# Altium project Analog Project.PrjPcb
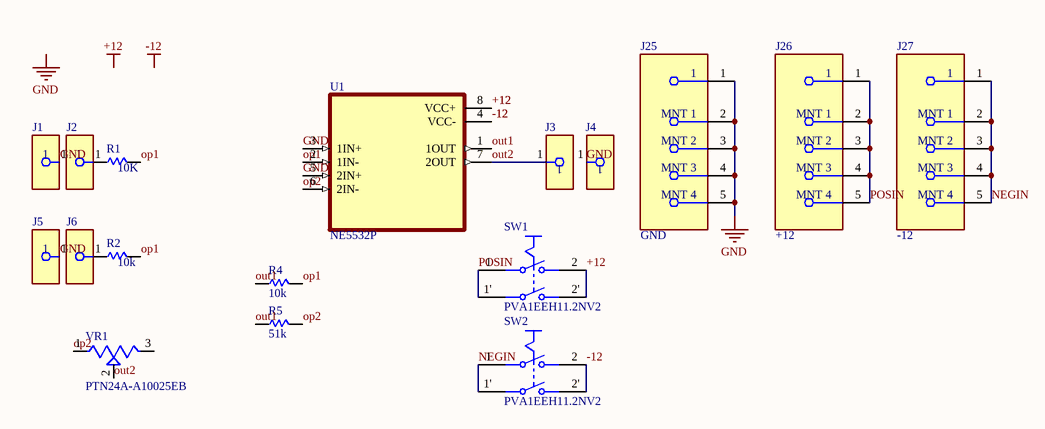
[diagram p0: Adder.SchDoc]
6 sheets, 157 parts. Net scope: global (net labels, ports and power ports of the same name join across sheets).
Board file: PCB1.PcbDoc
Sheets:
  Adder.SchDoc
  Subtractor.SchDoc
  Multiplier.SchDoc
  logMultiplier.SchDoc
  Intdiff.SchDoc
  gain.SchDoc

## Sheet Adder.SchDoc
size A; SheetNumber: 1; SheetTotal: 6

### Parts
J1  (no value)  [FP-1581-5-MFG]
J2  1581-5  [FP-1581-5-MFG]  (value not drawn)
J3  1581-5  [FP-1581-5-MFG]  (value not drawn)
J4  1581-5  [FP-1581-5-MFG]  (value not drawn)
J5  1581-5  [FP-1581-5-MFG]  (value not drawn)
J6  1581-5  [FP-1581-5-MFG]  (value not drawn)
J25  GND  [FP-FCR7350B-MFG]
J26  +12  [FP-FCR7350B-MFG]
J27  -12  [FP-FCR7350B-MFG]
R1  value 10K  [RESAD1100W55L680D260]  (hidden comment: MFR-25FBF52-1K)
R2  value 10k  [RESAD1100W55L680D260]  (hidden comment: MFR-25FBF52-1K)
R4  value 10k  [RESAD1100W55L680D260]  (hidden comment: MFR-25FBF52-1K)
R5  value 51k  [RESAD1100W55L680D260]  (hidden comment: MFR-25FBF52-1K)
SW1  PVA1EEH11.2NV2  [FP-PVA1EEH11_2NV2-MFG]
SW2  PVA1EEH11.2NV2  [FP-PVA1EEH11_2NV2-MFG]
U1  NE5532P  [DIP794W45P254L959H508Q8]
VR1  PTN24A-A10025EB  [TRIM_PTN24A-A10025EB]

### Nets
+12: SW1.2 SW1.2' U1.8(VCC+)
-12: SW2.2 SW2.2' U1.4(VCC-)
GND: J1.1 J4.1 J5.1 J25.1 J25.2(MNT_1) J25.3(MNT_2) J25.4(MNT_3) J25.5(MNT_4) U1.3(1IN+) U1.5(2IN+)
NEGIN: J27.1 J27.2(MNT_1) J27.3(MNT_2) J27.4(MNT_3) J27.5(MNT_4) SW2.1 SW2.1'
op1: R1.2 R2.2 R4.2 U1.2(1IN-)
op2: R5.2 U1.6(2IN-) VR1.1
out1: R4.1 R5.1 U1.1(1OUT)
out2: J3.1 U1.7(2OUT) VR1.2
POSIN: J26.1 J26.2(MNT_1) J26.3(MNT_2) J26.4(MNT_3) J26.5(MNT_4) SW1.1 SW1.1'
NetJ2_1: J2.1 R1.1
NetJ6_1: J6.1 R2.1

Not connected (* = marked no-connect by the designer): VR1 3

### Notes on the sheet
- Labels drawn without touching a wire or pin: +12, -12, GND

### Library data of the parts
J1-J6 = CMP-73906-000011-1: CONN BANANA JACK TURRET GREEN; Body Material: PC; Number of Contacts: 1; Max Current Rating: 15A; Voltage Rating (AC): 30V; Insulation: Mating End Insulated; Voltage Rating: 2.5kV; Voltage Rating (DC): 60V; Gender: Female; Height: 0.25inch; Mount: Panel; RoHS Compliant: Yes; Length: 1.22inch; Orientation: Straight; Diameter: 4.22mm; Lead Free: Lead Free; Package Quantity: 1; Termination: Turret; Current Rating: 15A; Packaging: Bag; Series: 1581; REACH SVHC: No SVHC; Number of Positions: 1; Contact Plating: Tin; Housing Color: Green; Contact Material: Brass; Insulation Material: Polycarbonate; Weight: 0.126lb; Number of Ports: 1; Color: Green; Housing Material: Polycarbonate; Width: 4inch
J25-J27 = CMP-213418-000001-1: 4MM PANEL SKT S16N-PC BLACK; Voltage Rating: 1kV; Gender: Receptacle; Connector Type: Socket; Current Rating: 24A; Pin Diameter: 4mm; Color: Black; Contact Material: Gold; Termination: Through Hole; Weight: 0.1lb; Height: 1.3inch; Width: 0.43inch; REACH SVHC: No SVHC; Voltage Rating (DC): 1kV; RoHS Compliant: Yes; Insulation Material: PVC; Length: 0.47inch; Mount: Through Hole; Contact Plating: Gold
R1 R2 R4 R5 = MFR-25FBF52-1K: 1.07 kOhms Â±1% 0.25W, 1/4W Through Hole Resistor Axial - Metal Film; MF: Yageo; SnapEDA_Link: https://www.snapeda.com/parts/MFR-25FBF52-1K/Yageo/view-part/?ref=snap; Package: RADIAL-2 YAGEO; MP: MFR-25FBF52-1K; Check_prices: https://www.snapeda.com/parts/MFR-25FBF52-1K/Yageo/view-part/?ref=eda
SW1 SW2 = CMP-10035-000009-1: SWITCH PUSH DPST 0.1A 32V; Switch Function: Off-On; Current Rating: 100mA; Electrical Life: 100000Cycles; RoHS Compliant: Yes; Throw Configuration: DPST; Max Operating Temperature: 85°C; Voltage Rating (DC): 32V; Mount: Through Hole; Series: PVA; Min Operating Temperature: -40°C; Termination: PC Pin; Packaging: Bulk
U1 = NE5532P: Dual, 30-V, 10-MHz, low-noise operational amplifier for audio applications; MF: Texas Instruments; SnapEDA_Link: https://www.snapeda.com/parts/NE5532P/Texas+Instruments/view-part/?ref=snap; Package: PDIP-8 Texas; Value: *; MP: NE5532P; Check_prices: https://www.snapeda.com/parts/NE5532P/Texas+Instruments/view-part/?ref=eda
VR1 = PTN24A-A10025EB: 100k Ohm 1 Gang Linear Panel Mount Potentiometer 1.0 Turns Carbon 0.5W, 1/2W PC Pins; MF: Same Sky; SnapEDA_Link: https://www.snapeda.com/parts/PTN24A-A10025EB/Same+Sky/view-part/?ref=snap; Package: Package; Value: *; MP: PTN24A-A10025EB; Check_prices: https://www.snapeda.com/parts/PTN24A-A10025EB/Same+Sky/view-part/?ref=eda

## Sheet Subtractor.SchDoc
size A; SheetNumber: 2; SheetTotal: 6
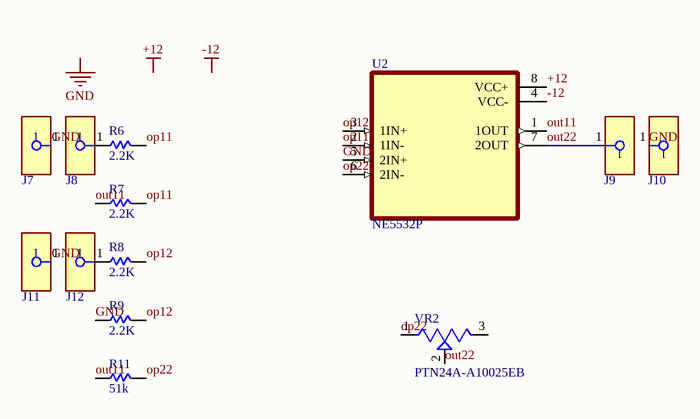
[diagram p1: Subtractor.SchDoc]

### Parts
J7  1581-5  [FP-1581-5-MFG]  (value not drawn)
J8  1581-5  [FP-1581-5-MFG]  (value not drawn)
J9  1581-5  [FP-1581-5-MFG]  (value not drawn)
J10  1581-5  [FP-1581-5-MFG]  (value not drawn)
J11  1581-5  [FP-1581-5-MFG]  (value not drawn)
J12  1581-5  [FP-1581-5-MFG]  (value not drawn)
R6  value 2.2K  [RESAD1100W55L680D260]  (hidden comment: MFR-25FBF52-1K)
R7  value 2.2K  [RESAD1100W55L680D260]  (hidden comment: MFR-25FBF52-1K)
R8  value 2.2K  [RESAD1100W55L680D260]  (hidden comment: MFR-25FBF52-1K)
R9  value 2.2K  [RESAD1100W55L680D260]  (hidden comment: MFR-25FBF52-1K)
R11  value 51k  [RESAD1100W55L680D260]  (hidden comment: MFR-25FBF52-1K)
U2  NE5532P  [DIP794W45P254L959H508Q8]
VR2  PTN24A-A10025EB  [TRIM_PTN24A-A10025EB]

### Nets
+12: U2.8(VCC+)
-12: U2.4(VCC-)
GND: J7.1 J10.1 J11.1 R9.1 U2.5(2IN+)
op11: R6.2 R7.2 U2.2(1IN-)
op12: R8.2 R9.2 U2.3(1IN+)
op22: R11.2 U2.6(2IN-) VR2.1
out11: R7.1 R11.1 U2.1(1OUT)
out22: J9.1 U2.7(2OUT) VR2.2
NetJ8_1: J8.1 R6.1
NetJ12_1: J12.1 R8.1

Not connected (* = marked no-connect by the designer): VR2 3

### Notes on the sheet
- Labels drawn without touching a wire or pin: +12, -12, GND

### Library data of the parts
J7-J12 = CMP-73906-000011-1: as J1 on sheet Adder; Height: 0.25inch; Mount: Panel; RoHS Compliant: Yes; Length: 1.22inch; Orientation: Straight; Diameter: 4.22mm; Lead Free: Lead Free; Package Quantity: 1; Termination: Turret; Current Rating: 15A; Packaging: Bag; Series: 1581; REACH SVHC: No SVHC; Number of Positions: 1; Contact Plating: Tin; Housing Color: Green; Contact Material: Brass; Insulation Material: Polycarbonate; Weight: 0.126lb; Number of Ports: 1; Color: Green; Housing Material: Polycarbonate; Width: 4inch
R6-R9 R11 = MFR-25FBF52-1K: as R1 on sheet Adder; SnapEDA_Link: https://www.snapeda.com/parts/MFR-25FBF52-1K/Yageo/view-part/?ref=snap; Package: RADIAL-2 YAGEO; MP: MFR-25FBF52-1K; Check_prices: https://www.snapeda.com/parts/MFR-25FBF52-1K/Yageo/view-part/?ref=eda
U2 = NE5532P: as U1 on sheet Adder; SnapEDA_Link: https://www.snapeda.com/parts/NE5532P/Texas+Instruments/view-part/?ref=snap; Package: PDIP-8 Texas; Value: *; MP: NE5532P; Check_prices: https://www.snapeda.com/parts/NE5532P/Texas+Instruments/view-part/?ref=eda
VR2 = PTN24A-A10025EB: as VR1 on sheet Adder; SnapEDA_Link: https://www.snapeda.com/parts/PTN24A-A10025EB/Same+Sky/view-part/?ref=snap; Package: Package; Value: *; MP: PTN24A-A10025EB; Check_prices: https://www.snapeda.com/parts/PTN24A-A10025EB/Same+Sky/view-part/?ref=eda

## Sheet Multiplier.SchDoc
size A; SheetNumber: 3; SheetTotal: 6
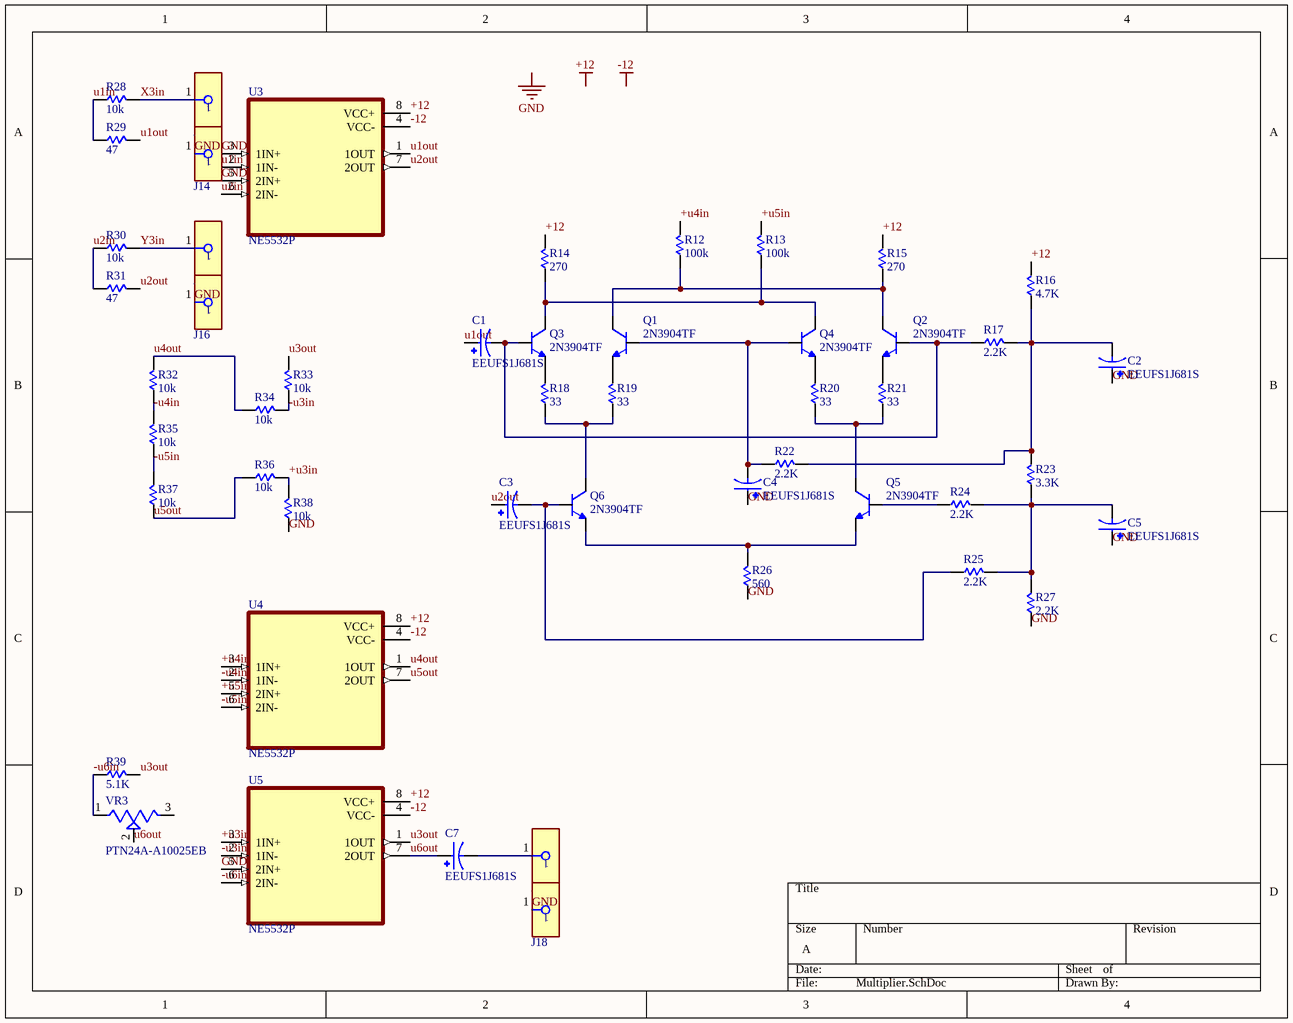
[diagram p2: Multiplier.SchDoc]

### Parts
C1  EEUFS1J681S  [CAPPRD250W50D630H1250]
C2  EEUFS1J681S  [CAPPRD250W50D630H1250]
C3  EEUFS1J681S  [CAPPRD250W50D630H1250]
C4  EEUFS1J681S  [CAPPRD250W50D630H1250]
C5  EEUFS1J681S  [CAPPRD250W50D630H1250]
C7  EEUFS1J681S  [CAPPRD250W50D630H1250]
J13  1581-5  [FP-1581-5-MFG]  (value not drawn)
J14  1581-5  [FP-1581-5-MFG]  (value not drawn)
J15  1581-5  [FP-1581-5-MFG]  (value not drawn)
J16  1581-5  [FP-1581-5-MFG]  (value not drawn)
J17  1581-5  [FP-1581-5-MFG]  (value not drawn)
J18  1581-5  [FP-1581-5-MFG]  (value not drawn)
Q1  2N3904TF  [TO92254P520H877-3]
Q2  2N3904TF  [TO92254P520H877-3]
Q3  2N3904TF  [TO92254P520H877-3]
Q4  2N3904TF  [TO92254P520H877-3]
Q5  2N3904TF  [TO92254P520H877-3]
Q6  2N3904TF  [TO92254P520H877-3]
R12  value 100k  [RESAD1100W55L680D260]  (hidden comment: MFR-25FBF52-1K)
R13  value 100k  [RESAD1100W55L680D260]  (hidden comment: MFR-25FBF52-1K)
R14  value 270  [RESAD1100W55L680D260]  (hidden comment: MFR-25FBF52-1K)
R15  value 270  [RESAD1100W55L680D260]  (hidden comment: MFR-25FBF52-1K)
R16  value 4.7K  [RESAD1100W55L680D260]  (hidden comment: MFR-25FBF52-1K)
R17  value 2.2K  [RESAD1100W55L680D260]  (hidden comment: MFR-25FBF52-1K)
R18  value 33  [RESAD1100W55L680D260]  (hidden comment: MFR-25FBF52-1K)
R19  value 33  [RESAD1100W55L680D260]  (hidden comment: MFR-25FBF52-1K)
R20  value 33  [RESAD1100W55L680D260]  (hidden comment: MFR-25FBF52-1K)
R21  value 33  [RESAD1100W55L680D260]  (hidden comment: MFR-25FBF52-1K)
R22  value 2.2K  [RESAD1100W55L680D260]  (hidden comment: MFR-25FBF52-1K)
R23  value 3.3K  [RESAD1100W55L680D260]  (hidden comment: MFR-25FBF52-1K)
R24  value 2.2K  [RESAD1100W55L680D260]  (hidden comment: MFR-25FBF52-1K)
R25  value 2.2K  [RESAD1100W55L680D260]  (hidden comment: MFR-25FBF52-1K)
R26  value 560  [RESAD1100W55L680D260]  (hidden comment: MFR-25FBF52-1K)
R27  value 2.2K  [RESAD1100W55L680D260]  (hidden comment: MFR-25FBF52-1K)
R28  value 10k  [RESAD1100W55L680D260]  (hidden comment: MFR-25FBF52-1K)
R29  value 47  [RESAD1100W55L680D260]  (hidden comment: MFR-25FBF52-1K)
R30  value 10k  [RESAD1100W55L680D260]  (hidden comment: MFR-25FBF52-1K)
R31  value 47  [RESAD1100W55L680D260]  (hidden comment: MFR-25FBF52-1K)
R32  value 10k  [RESAD1100W55L680D260]  (hidden comment: MFR-25FBF52-1K)
R33  value 10k  [RESAD1100W55L680D260]  (hidden comment: MFR-25FBF52-1K)
R34  value 10k  [RESAD1100W55L680D260]  (hidden comment: MFR-25FBF52-1K)
R35  value 10k  [RESAD1100W55L680D260]  (hidden comment: MFR-25FBF52-1K)
R36  value 10k  [RESAD1100W55L680D260]  (hidden comment: MFR-25FBF52-1K)
R37  value 10k  [RESAD1100W55L680D260]  (hidden comment: MFR-25FBF52-1K)
R38  value 10k  [RESAD1100W55L680D260]  (hidden comment: MFR-25FBF52-1K)
R39  value 5.1K  [RESAD1100W55L680D260]  (hidden comment: MFR-25FBF52-1K)
U3  NE5532P  [DIP794W45P254L959H508Q8]
U4  NE5532P  [DIP794W45P254L959H508Q8]
U5  NE5532P  [DIP794W45P254L959H508Q8]
VR3  PTN24A-A10025EB  [TRIM_PTN24A-A10025EB]

### Nets
+12: R14.2 R15.2 R16.2 U3.8(VCC+) U4.8(VCC+) U5.8(VCC+)
-12: U3.4(VCC-) U4.4(VCC-) U5.4(VCC-)
GND: C2.P C4.P C5.P J14.1 J16.1 J18.1 R26.1 R27.1 R38.1 U3.3(1IN+) U3.5(2IN+) U5.5(2IN+)
+u3in: R36.2 R38.2 U5.3(1IN+)
+u4in: R12.2 U4.3(1IN+)
+u5in: R13.2 U4.5(2IN+)
-u3in: R33.1 R34.2 U5.2(1IN-)
-u4in: R32.1 R35.2 U4.2(1IN-)
-u5in: R35.1 R37.2 U4.6(2IN-)
-u6in: R39.1 U5.6(2IN-) VR3.1
u1in: R28.1 R29.1 U3.2(1IN-)
u1out: C1.P R29.2 U3.1(1OUT)
u2in: R30.1 R31.1 U3.6(2IN-)
u2out: C3.P R31.2 U3.7(2OUT)
u3out: R33.2 R39.2 U5.1(1OUT)
u4out: R32.2 R34.1 U4.1(1OUT)
u5out: R36.1 R37.1 U4.7(2OUT)
u6out: C7.P U5.7(2OUT) VR3.2
X3in: J13.1 R28.2
Y3in: J15.1 R30.2
NetC1_N: C1.N Q2.2(B) Q3.2(B) R17.1
NetC2_N: C2.N R16.1 R17.2 R22.2 R23.2
NetC3_N: C3.N Q6.2(B) R25.1
NetC4_N: C4.N Q1.2(B) Q4.2(B) R22.1
NetC5_N: C5.N R23.1 R24.2 R25.2 R27.2
NetC7_N: C7.N J17.1
NetQ1_1: Q1.1(E) R19.2
NetQ1_3: Q1.3(C) Q2.3(C) R12.1 R15.1
NetQ2_1: Q2.1(E) R21.2
NetQ3_1: Q3.1(E) R18.2
NetQ3_3: Q3.3(C) Q4.3(C) R13.1 R14.1
NetQ4_1: Q4.1(E) R20.2
NetQ5_1: Q5.1(E) Q6.1(E) R26.2
NetQ5_2: Q5.2(B) R24.1
NetQ5_3: Q5.3(C) R20.1 R21.1
NetQ6_3: Q6.3(C) R18.1 R19.1

Not connected (* = marked no-connect by the designer): VR3 3

### Notes on the sheet
- Labels drawn without touching a wire or pin: +12, -12, GND

### Library data of the parts
C1-C5 C7 = EEUFS1J681S: CAP ALUM 680UF 20% 63V THRU HOLE; MP: EEU-FS1J681S; MF: Panasonic Electronic Components; Package: RADIAL-2 Panasonic; Availability: In Stock; SnapEDA_Link: https://www.snapeda.com/parts/EEU-FS1J681S/Panasonic/view-part/5562022/?ref=snap; Price: None; Check_prices: https://www.snapeda.com/parts/EEU-FS1J681S/Panasonic/view-part/5562022/?ref=eda; Value: *
J13-J18 = CMP-73906-000011-1: as J1 on sheet Adder; Height: 0.25inch; Mount: Panel; RoHS Compliant: Yes; Length: 1.22inch; Orientation: Straight; Diameter: 4.22mm; Lead Free: Lead Free; Package Quantity: 1; Termination: Turret; Current Rating: 15A; Packaging: Bag; Series: 1581; REACH SVHC: No SVHC; Number of Positions: 1; Contact Plating: Tin; Housing Color: Green; Contact Material: Brass; Insulation Material: Polycarbonate; Weight: 0.126lb; Number of Ports: 1; Color: Green; Housing Material: Polycarbonate; Width: 4inch
Q1-Q6 = 2N3904TF: Transistor General Purpose BJT NPN 40 Volt 0.2 Amp 3-Pin TO-92 Tape And Reel; MF: Fairchild Semiconductor; SnapEDA_Link: https://www.snapeda.com/parts/2N3904TF/Fairchild+Imaging/view-part/?ref=snap; Package: TO-92-3 ON Semiconductor; Value: *; MP: 2N3904TF; Check_prices: https://www.snapeda.com/parts/2N3904TF/Fairchild+Imaging/view-part/?ref=eda
R12-R39 = MFR-25FBF52-1K: as R1 on sheet Adder; SnapEDA_Link: https://www.snapeda.com/parts/MFR-25FBF52-1K/Yageo/view-part/?ref=snap; Package: RADIAL-2 YAGEO; MP: MFR-25FBF52-1K; Check_prices: https://www.snapeda.com/parts/MFR-25FBF52-1K/Yageo/view-part/?ref=eda
U3-U5 = NE5532P: as U1 on sheet Adder; SnapEDA_Link: https://www.snapeda.com/parts/NE5532P/Texas+Instruments/view-part/?ref=snap; Package: PDIP-8 Texas; Value: *; MP: NE5532P; Check_prices: https://www.snapeda.com/parts/NE5532P/Texas+Instruments/view-part/?ref=eda
VR3 = PTN24A-A10025EB: as VR1 on sheet Adder; SnapEDA_Link: https://www.snapeda.com/parts/PTN24A-A10025EB/Same+Sky/view-part/?ref=snap; Package: Package; Value: *; MP: PTN24A-A10025EB; Check_prices: https://www.snapeda.com/parts/PTN24A-A10025EB/Same+Sky/view-part/?ref=eda

## Sheet logMultiplier.SchDoc
size OrCAD B; SheetNumber: 4; SheetTotal: 6
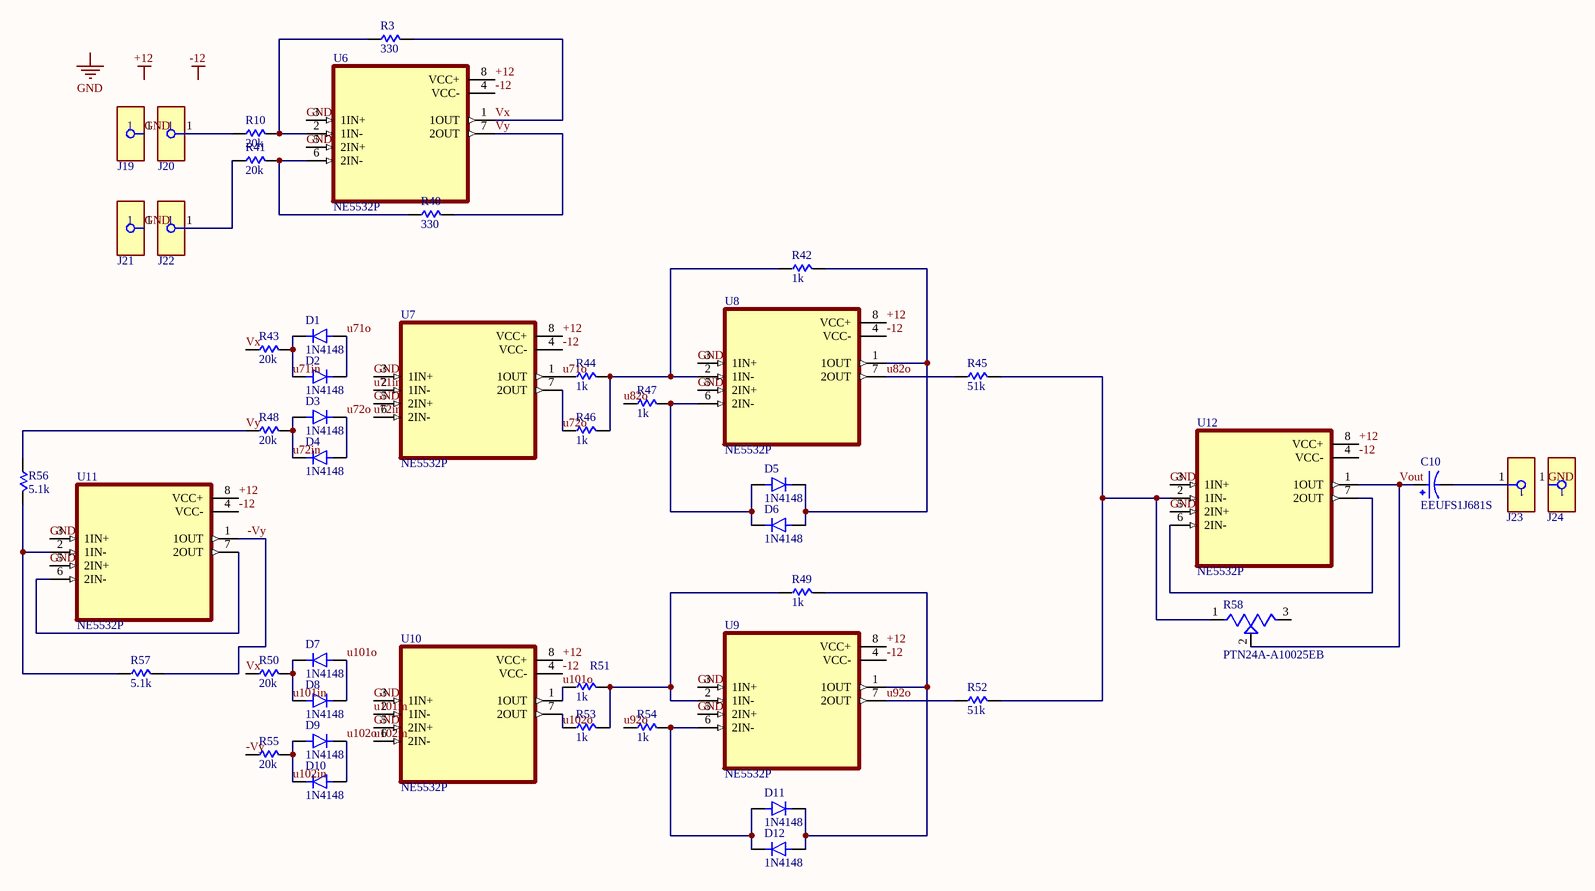
[diagram p3: logMultiplier.SchDoc]

### Parts
C10  EEUFS1J681S  [CAPPRD250W50D630H1250]
D1  1N4148  [DIOAD753W49L380D172B]
D2  1N4148  [DIOAD753W49L380D172B]
D3  1N4148  [DIOAD753W49L380D172B]
D4  1N4148  [DIOAD753W49L380D172B]
D5  1N4148  [DIOAD753W49L380D172B]
D6  1N4148  [DIOAD753W49L380D172B]
D7  1N4148  [DIOAD753W49L380D172B]
D8  1N4148  [DIOAD753W49L380D172B]
D9  1N4148  [DIOAD753W49L380D172B]
D10  1N4148  [DIOAD753W49L380D172B]
D11  1N4148  [DIOAD753W49L380D172B]
D12  1N4148  [DIOAD753W49L380D172B]
J19  1581-5  [FP-1581-5-MFG]  (value not drawn)
J20  1581-5  [FP-1581-5-MFG]  (value not drawn)
J21  1581-5  [FP-1581-5-MFG]  (value not drawn)
J22  1581-5  [FP-1581-5-MFG]  (value not drawn)
J23  1581-5  [FP-1581-5-MFG]  (value not drawn)
J24  1581-5  [FP-1581-5-MFG]  (value not drawn)
R3  value 330  [RESAD1100W55L680D260]  (hidden comment: MFR-25FBF52-1K)
R10  value 20k  [RESAD1100W55L680D260]  (hidden comment: MFR-25FBF52-1K)
R40  value 330  [RESAD1100W55L680D260]  (hidden comment: MFR-25FBF52-1K)
R41  value 20k  [RESAD1100W55L680D260]  (hidden comment: MFR-25FBF52-1K)
R42  value 1k  [RESAD1100W55L680D260]  (hidden comment: MFR-25FBF52-1K)
R43  value 20k  [RESAD1100W55L680D260]  (hidden comment: MFR-25FBF52-1K)
R44  value 1k  [RESAD1100W55L680D260]  (hidden comment: MFR-25FBF52-1K)
R45  value 51k  [RESAD1100W55L680D260]  (hidden comment: MFR-25FBF52-1K)
R46  value 1k  [RESAD1100W55L680D260]  (hidden comment: MFR-25FBF52-1K)
R47  value 1k  [RESAD1100W55L680D260]  (hidden comment: MFR-25FBF52-1K)
R48  value 20k  [RESAD1100W55L680D260]  (hidden comment: MFR-25FBF52-1K)
R49  value 1k  [RESAD1100W55L680D260]  (hidden comment: MFR-25FBF52-1K)
R50  value 20k  [RESAD1100W55L680D260]  (hidden comment: MFR-25FBF52-1K)
R51  value 1k  [RESAD1100W55L680D260]  (hidden comment: MFR-25FBF52-1K)
R52  value 51k  [RESAD1100W55L680D260]  (hidden comment: MFR-25FBF52-1K)
R53  value 1k  [RESAD1100W55L680D260]  (hidden comment: MFR-25FBF52-1K)
R54  value 1k  [RESAD1100W55L680D260]  (hidden comment: MFR-25FBF52-1K)
R55  value 20k  [RESAD1100W55L680D260]  (hidden comment: MFR-25FBF52-1K)
R56  value 5.1k  [RESAD1100W55L680D260]  (hidden comment: MFR-25FBF52-1K)
R57  value 5.1k  [RESAD1100W55L680D260]  (hidden comment: MFR-25FBF52-1K)
R58  PTN24A-A10025EB  [TRIM_PTN24A-A10025EB]
U6  NE5532P  [DIP794W45P254L959H508Q8]
U7  NE5532P  [DIP794W45P254L959H508Q8]
U8  NE5532P  [DIP794W45P254L959H508Q8]
U9  NE5532P  [DIP794W45P254L959H508Q8]
U10  NE5532P  [DIP794W45P254L959H508Q8]
U11  NE5532P  [DIP794W45P254L959H508Q8]
U12  NE5532P  [DIP794W45P254L959H508Q8]

### Nets
+12: U6.8(VCC+) U7.8(VCC+) U8.8(VCC+) U9.8(VCC+) U10.8(VCC+) U11.8(VCC+) U12.8(VCC+)
-12: U6.4(VCC-) U7.4(VCC-) U8.4(VCC-) U9.4(VCC-) U10.4(VCC-) U11.4(VCC-) U12.4(VCC-)
GND: J19.1 J21.1 J24.1 U6.3(1IN+) U6.5(2IN+) U7.3(1IN+) U7.5(2IN+) U8.3(1IN+) U8.5(2IN+) U9.3(1IN+) U9.5(2IN+) U10.3(1IN+) U10.5(2IN+) U11.3(1IN+) U11.5(2IN+) U12.3(1IN+) U12.5(2IN+)
-Vy: R55.1 R57.2 U11.1(1OUT)
u71in: D1.K D2.A R43.2 U7.2(1IN-)
u71o: D1.A D2.K R44.1 U7.1(1OUT)
u72in: D3.A D4.K R48.2 U7.6(2IN-)
u72o: D3.K D4.A R46.1 U7.7(2OUT)
u82o: R45.1 R47.1 U8.7(2OUT)
u92o: R52.1 R54.1 U9.7(2OUT)
u101in: D7.K D8.A R50.2 U10.2(1IN-)
u101o: D7.A D8.K R51.1 U10.1(1OUT)
u102in: D9.A D10.K R55.2 U10.6(2IN-)
u102o: D9.K D10.A R53.1 U10.7(2OUT)
Vout: C10.P R58.2 U12.1(1OUT)
Vx: R3.2 R43.1 R50.1 U6.1(1OUT)
Vy: R40.2 R48.1 R56.1 U6.7(2OUT)
NetC10_N: C10.N J23.1
NetD5_A: D5.A D6.K R47.2 U8.6(2IN-)
NetD5_K: D5.K D6.A R42.2 U8.1(1OUT)
NetD11_A: D11.A D12.K R54.2 U9.6(2IN-)
NetD11_K: D11.K D12.A R49.2 U9.1(1OUT)
NetJ20_1: J20.1 R10.1
NetJ22_1: J22.1 R41.1
NetR3_1: R3.1 R10.2 U6.2(1IN-)
NetR40_1: R40.1 R41.2 U6.6(2IN-)
NetR42_1: R42.1 R44.2 R46.2 U8.2(1IN-)
NetR45_2: R45.2 R52.2 R58.1 U12.2(1IN-)
NetR49_1: R49.1 R51.2 R53.2 U9.2(1IN-)
NetR56_2: R56.2 R57.1 U11.2(1IN-)
NetU11_6: U11.6(2IN-) U11.7(2OUT)
NetU12_6: U12.6(2IN-) U12.7(2OUT)

Not connected (* = marked no-connect by the designer): R58 3

### Notes on the sheet
- Labels drawn without touching a wire or pin: +12, -12, GND

### Library data of the parts
C10 = EEUFS1J681S: as C1 on sheet Multiplier; Package: RADIAL-2 Panasonic; Availability: In Stock; SnapEDA_Link: https://www.snapeda.com/parts/EEU-FS1J681S/Panasonic/view-part/5562022/?ref=snap; Price: None; Check_prices: https://www.snapeda.com/parts/EEU-FS1J681S/Panasonic/view-part/5562022/?ref=eda; Value: *
D1-D12 = 1N4148: Diode Standard 75V 200mA Surface Mount SOD-523F; MF: ON Semiconductor; SnapEDA_Link: https://www.snapeda.com/parts/1N4148/Onsemi/view-part/?ref=snap; Package: AXIAL LEAD-2 ON Semiconductor; Value: *; MP: 1N4148; Check_prices: https://www.snapeda.com/parts/1N4148/Onsemi/view-part/?ref=eda
J19-J24 = CMP-73906-000011-1: as J1 on sheet Adder; Height: 0.25inch; Mount: Panel; RoHS Compliant: Yes; Length: 1.22inch; Orientation: Straight; Diameter: 4.22mm; Lead Free: Lead Free; Package Quantity: 1; Termination: Turret; Current Rating: 15A; Packaging: Bag; Series: 1581; REACH SVHC: No SVHC; Number of Positions: 1; Contact Plating: Tin; Housing Color: Green; Contact Material: Brass; Insulation Material: Polycarbonate; Weight: 0.126lb; Number of Ports: 1; Color: Green; Housing Material: Polycarbonate; Width: 4inch
R3 R10 R40-R57 = MFR-25FBF52-1K: as R1 on sheet Adder; SnapEDA_Link: https://www.snapeda.com/parts/MFR-25FBF52-1K/Yageo/view-part/?ref=snap; Package: RADIAL-2 YAGEO; MP: MFR-25FBF52-1K; Check_prices: https://www.snapeda.com/parts/MFR-25FBF52-1K/Yageo/view-part/?ref=eda
R58 = PTN24A-A10025EB: as VR1 on sheet Adder; SnapEDA_Link: https://www.snapeda.com/parts/PTN24A-A10025EB/Same+Sky/view-part/?ref=snap; Package: Package; Value: *; MP: PTN24A-A10025EB; Check_prices: https://www.snapeda.com/parts/PTN24A-A10025EB/Same+Sky/view-part/?ref=eda
U6-U12 = NE5532P: as U1 on sheet Adder; SnapEDA_Link: https://www.snapeda.com/parts/NE5532P/Texas+Instruments/view-part/?ref=snap; Package: PDIP-8 Texas; Value: *; MP: NE5532P; Check_prices: https://www.snapeda.com/parts/NE5532P/Texas+Instruments/view-part/?ref=eda

## Sheet Intdiff.SchDoc
size A; SheetNumber: 5; SheetTotal: 5
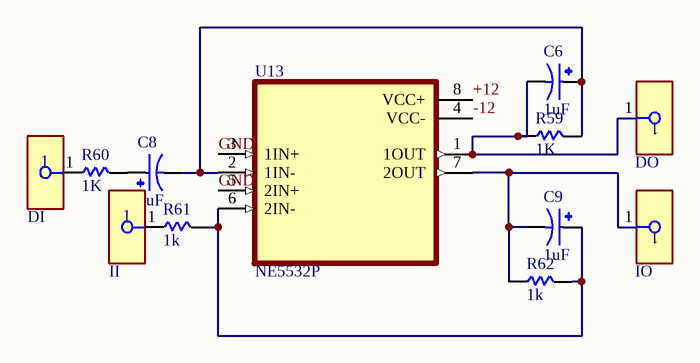
[diagram p4: Intdiff.SchDoc]

### Parts
C6  1uF  [CAPPRD250W50D630H1250]
C8  1uF  [CAPPRD250W50D630H1250]
C9  1uF  [CAPPRD250W50D630H1250]
DI  1581-5  [FP-1581-5-MFG]  (value not drawn)
DO  1581-5  [FP-1581-5-MFG]  (value not drawn)
II  1581-5  [FP-1581-5-MFG]  (value not drawn)
IO  1581-5  [FP-1581-5-MFG]  (value not drawn)
R59  value 1K  [RESAD1100W55L680D260]  (hidden comment: MFR-25FBF52-1K)
R60  value 1K  [RESAD1100W55L680D260]  (hidden comment: MFR-25FBF52-1K)
R61  value 1k  [RESAD1100W55L680D260]  (hidden comment: MFR-25FBF52-1K)
R62  value 1k  [RESAD1100W55L680D260]  (hidden comment: MFR-25FBF52-1K)
U13  NE5532P  [DIP794W45P254L959H508Q8]

### Nets
+12: U13.8(VCC+)
-12: U13.4(VCC-)
GND: U13.3(1IN+) U13.5(2IN+)
NetC6_N: C6.N DO.1 R59.1 U13.1(1OUT)
NetC6_P: C6.P C8.N R59.2 U13.2(1IN-)
NetC8_P: C8.P R60.2
NetC9_N: C9.N IO.1 R62.1 U13.7(2OUT)
NetC9_P: C9.P R61.2 R62.2 U13.6(2IN-)
NetDI_1: DI.1 R60.1
NetII_1: II.1 R61.1

### Library data of the parts
C6 C8 C9 = EEUFS1J681S: as C1 on sheet Multiplier; Package: RADIAL-2 Panasonic; Availability: In Stock; SnapEDA_Link: https://www.snapeda.com/parts/EEU-FS1J681S/Panasonic/view-part/5562022/?ref=snap; Price: None; Check_prices: https://www.snapeda.com/parts/EEU-FS1J681S/Panasonic/view-part/5562022/?ref=eda; Value: *
DI DO II IO = CMP-73906-000011-1: as J1 on sheet Adder; Height: 0.25inch; Mount: Panel; RoHS Compliant: Yes; Length: 1.22inch; Orientation: Straight; Diameter: 4.22mm; Lead Free: Lead Free; Package Quantity: 1; Termination: Turret; Current Rating: 15A; Packaging: Bag; Series: 1581; REACH SVHC: No SVHC; Number of Positions: 1; Contact Plating: Tin; Housing Color: Green; Contact Material: Brass; Insulation Material: Polycarbonate; Weight: 0.126lb; Number of Ports: 1; Color: Green; Housing Material: Polycarbonate; Width: 4inch
R59-R62 = MFR-25FBF52-1K: as R1 on sheet Adder; SnapEDA_Link: https://www.snapeda.com/parts/MFR-25FBF52-1K/Yageo/view-part/?ref=snap; Package: RADIAL-2 YAGEO; MP: MFR-25FBF52-1K; Check_prices: https://www.snapeda.com/parts/MFR-25FBF52-1K/Yageo/view-part/?ref=eda
U13 = NE5532P: as U1 on sheet Adder; SnapEDA_Link: https://www.snapeda.com/parts/NE5532P/Texas+Instruments/view-part/?ref=snap; Package: PDIP-8 Texas; Value: *; MP: NE5532P; Check_prices: https://www.snapeda.com/parts/NE5532P/Texas+Instruments/view-part/?ref=eda

## Sheet gain.SchDoc
size A; SheetNumber: 6; SheetTotal: 6
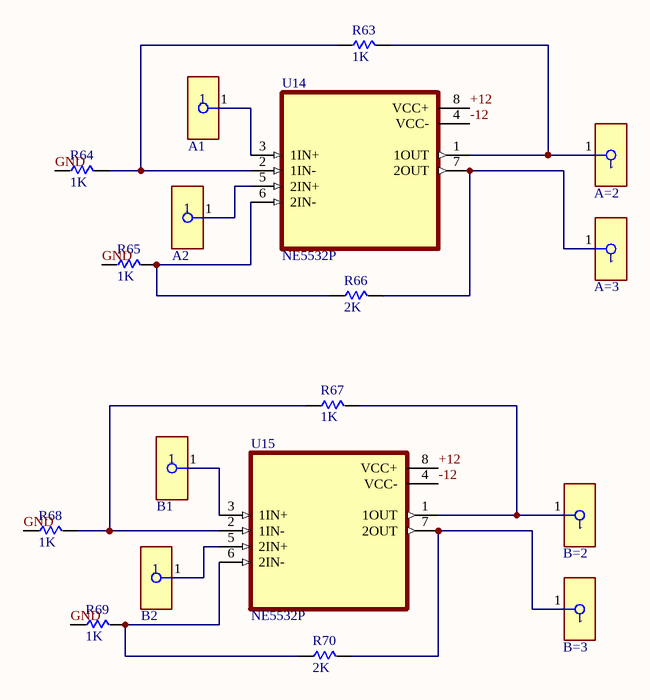
[diagram p5: gain.SchDoc]

### Parts
A1  1581-5  [FP-1581-5-MFG]  (value not drawn)
A2  1581-5  [FP-1581-5-MFG]  (value not drawn)
A=2  1581-5  [FP-1581-5-MFG]  (value not drawn)
A=3  1581-5  [FP-1581-5-MFG]  (value not drawn)
B1  1581-5  [FP-1581-5-MFG]  (value not drawn)
B2  1581-5  [FP-1581-5-MFG]  (value not drawn)
B=2  1581-5  [FP-1581-5-MFG]  (value not drawn)
B=3  1581-5  [FP-1581-5-MFG]  (value not drawn)
R63  value 1K  [RESAD1100W55L680D260]  (hidden comment: MFR-25FBF52-1K)
R64  value 1K  [RESAD1100W55L680D260]  (hidden comment: MFR-25FBF52-1K)
R65  value 1K  [RESAD1100W55L680D260]  (hidden comment: MFR-25FBF52-1K)
R66  value 2K  [RESAD1100W55L680D260]  (hidden comment: MFR-25FBF52-1K)
R67  value 1K  [RESAD1100W55L680D260]  (hidden comment: MFR-25FBF52-1K)
R68  value 1K  [RESAD1100W55L680D260]  (hidden comment: MFR-25FBF52-1K)
R69  value 1K  [RESAD1100W55L680D260]  (hidden comment: MFR-25FBF52-1K)
R70  value 2K  [RESAD1100W55L680D260]  (hidden comment: MFR-25FBF52-1K)
U14  NE5532P  [DIP794W45P254L959H508Q8]
U15  NE5532P  [DIP794W45P254L959H508Q8]

### Nets
+12: U14.8(VCC+) U15.8(VCC+)
-12: U14.4(VCC-) U15.4(VCC-)
GND: R64.1 R65.1 R68.1 R69.1
NetA1_1: A1.1 U14.3(1IN+)
NetA2_1: A2.1 U14.5(2IN+)
NetA=2_1: A=2.1 R63.2 U14.1(1OUT)
NetA=3_1: A=3.1 R66.2 U14.7(2OUT)
NetB1_1: B1.1 U15.3(1IN+)
NetB2_1: B2.1 U15.5(2IN+)
NetB=2_1: B=2.1 R67.2 U15.1(1OUT)
NetB=3_1: B=3.1 R70.2 U15.7(2OUT)
NetR63_1: R63.1 R64.2 U14.2(1IN-)
NetR65_2: R65.2 R66.1 U14.6(2IN-)
NetR67_1: R67.1 R68.2 U15.2(1IN-)
NetR69_2: R69.2 R70.1 U15.6(2IN-)

### Library data of the parts
A1 A2 A=2 A=3 B1 B2 B=2 B=3 = CMP-73906-000011-1: as J1 on sheet Adder; Height: 0.25inch; Mount: Panel; RoHS Compliant: Yes; Length: 1.22inch; Orientation: Straight; Diameter: 4.22mm; Lead Free: Lead Free; Package Quantity: 1; Termination: Turret; Current Rating: 15A; Packaging: Bag; Series: 1581; REACH SVHC: No SVHC; Number of Positions: 1; Contact Plating: Tin; Housing Color: Green; Contact Material: Brass; Insulation Material: Polycarbonate; Weight: 0.126lb; Number of Ports: 1; Color: Green; Housing Material: Polycarbonate; Width: 4inch
R63-R70 = MFR-25FBF52-1K: as R1 on sheet Adder; SnapEDA_Link: https://www.snapeda.com/parts/MFR-25FBF52-1K/Yageo/view-part/?ref=snap; Package: RADIAL-2 YAGEO; MP: MFR-25FBF52-1K; Check_prices: https://www.snapeda.com/parts/MFR-25FBF52-1K/Yageo/view-part/?ref=eda
U14 U15 = NE5532P: as U1 on sheet Adder; SnapEDA_Link: https://www.snapeda.com/parts/NE5532P/Texas+Instruments/view-part/?ref=snap; Package: PDIP-8 Texas; Value: *; MP: NE5532P; Check_prices: https://www.snapeda.com/parts/NE5532P/Texas+Instruments/view-part/?ref=eda

## Nets that join several sheets
+12: Adder (SW1.2 SW1.2' U1.8), Subtractor (U2.8), Multiplier (6 pins), logMultiplier (7 pins), Intdiff (U13.8), gain (U14.8 U15.8)
-12: Adder (SW2.2 SW2.2' U1.4), Subtractor (U2.4), Multiplier (U3.4 U4.4 U5.4), logMultiplier (7 pins), Intdiff (U13.4), gain (U14.4 U15.4)
GND: Adder (10 pins), Subtractor (5 pins), Multiplier (12 pins), logMultiplier (17 pins), Intdiff (U13.3 U13.5), gain (R64.1 R65.1 R68.1 R69.1)